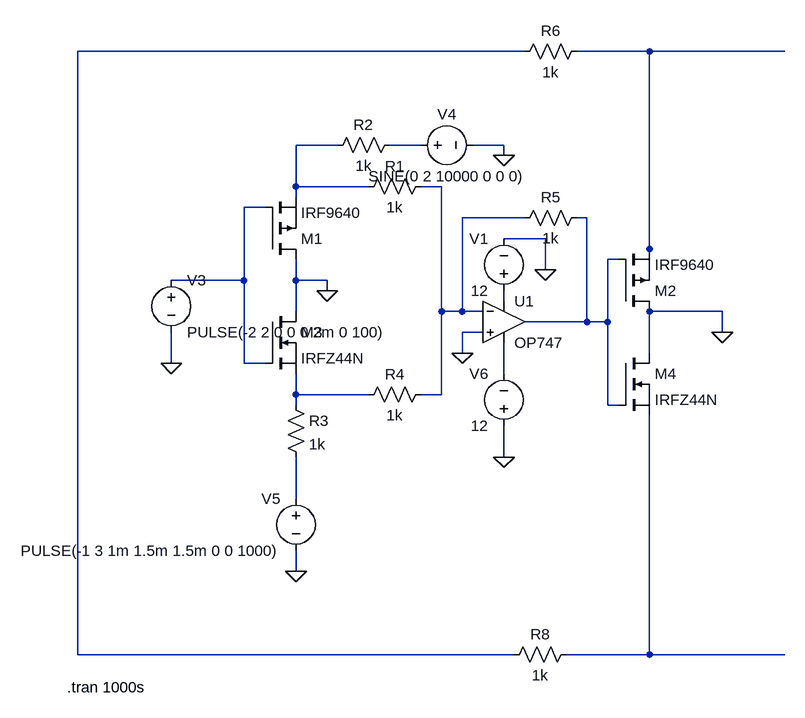
[diagram p0: schematic tdm.asc]
tdm.asc, the LTspice schematic file:
Version 4
SHEET 1 880 680
WIRE 432 -464 -256 -464
WIRE 624 -464 512 -464
WIRE 832 -464 624 -464
WIRE 144 -320 80 -320
WIRE 272 -320 224 -320
WIRE 400 -320 352 -320
WIRE 400 -304 400 -320
WIRE 80 -256 80 -320
WIRE 192 -256 80 -256
WIRE 304 -256 272 -256
WIRE 80 -240 80 -256
WIRE 32 -224 0 -224
WIRE 432 -208 336 -208
WIRE 528 -208 512 -208
WIRE 464 -176 400 -176
WIRE 624 -160 624 -464
WIRE 576 -144 560 -144
WIRE 624 -144 624 -160
WIRE 464 -128 464 -176
WIRE 0 -112 0 -224
WIRE 0 -112 -112 -112
WIRE 80 -112 80 -144
WIRE 128 -112 80 -112
WIRE 128 -96 128 -112
WIRE 400 -80 400 -96
WIRE 80 -64 80 -112
WIRE 304 -64 304 -256
WIRE 336 -64 336 -208
WIRE 336 -64 304 -64
WIRE 368 -64 336 -64
WIRE 736 -64 624 -64
WIRE 528 -48 528 -208
WIRE 528 -48 432 -48
WIRE 560 -48 560 -144
WIRE 560 -48 528 -48
WIRE 368 -32 336 -32
WIRE 736 -32 736 -64
WIRE 336 0 336 -32
WIRE 624 0 624 -64
WIRE -112 16 -112 -32
WIRE 0 16 0 -112
WIRE 32 16 0 16
WIRE 400 32 400 -16
WIRE 80 64 80 32
WIRE 192 64 80 64
WIRE 304 64 304 -64
WIRE 304 64 272 64
WIRE 80 80 80 64
WIRE 560 80 560 -48
WIRE 576 80 560 80
WIRE 400 160 400 112
WIRE 80 224 80 160
WIRE 80 336 80 304
WIRE -256 464 -256 -464
WIRE 416 464 -256 464
WIRE 624 464 624 96
WIRE 624 464 496 464
WIRE 832 464 624 464
FLAG 128 -96 0
FLAG 336 0 0
FLAG 464 -128 0
FLAG 736 -32 0
FLAG 400 -304 0
FLAG 80 336 0
FLAG -112 16 0
FLAG 400 160 0
SYMBOL pmos 32 -144 M180
SYMATTR InstName M1
SYMATTR Value IRF9640
SYMBOL nmos 32 -64 R0
SYMATTR InstName M3
SYMATTR Value IRFZ44N
SYMBOL res 288 -272 R90
WINDOW 0 0 56 VBottom 2
WINDOW 3 32 56 VTop 2
SYMATTR InstName R1
SYMATTR Value 1k
SYMBOL res 240 -336 R90
WINDOW 0 0 56 VBottom 2
WINDOW 3 32 56 VTop 2
SYMATTR InstName R2
SYMATTR Value 1k
SYMBOL res 64 64 R0
SYMATTR InstName R3
SYMATTR Value 1k
SYMBOL res 288 48 R90
WINDOW 0 0 56 VBottom 2
WINDOW 3 32 56 VTop 2
SYMATTR InstName R4
SYMATTR Value 1k
SYMBOL Opamps\\OP747 400 -112 R0
SYMATTR InstName U1
SYMBOL res 528 -224 R90
WINDOW 0 0 56 VBottom 2
WINDOW 3 32 56 VTop 2
SYMATTR InstName R5
SYMATTR Value 1k
SYMBOL pmos 576 -64 M180
SYMATTR InstName M2
SYMATTR Value IRF9640
SYMBOL nmos 576 0 R0
SYMATTR InstName M4
SYMATTR Value IRFZ44N
SYMBOL voltage 400 -80 R180
WINDOW 0 24 96 Left 2
WINDOW 3 24 16 Left 2
WINDOW 123 0 0 Left 0
WINDOW 39 0 0 Left 0
SYMATTR InstName V1
SYMATTR Value 12
SYMBOL res 528 -480 R90
WINDOW 0 0 56 VBottom 2
WINDOW 3 32 56 VTop 2
SYMATTR InstName R6
SYMATTR Value 1k
SYMBOL res 512 448 R90
WINDOW 0 0 56 VBottom 2
WINDOW 3 32 56 VTop 2
SYMATTR InstName R8
SYMATTR Value 1k
SYMBOL voltage -112 -128 R0
WINDOW 123 24 44 Left 2
WINDOW 39 0 0 Left 0
SYMATTR InstName V3
SYMATTR Value PULSE(-2 2 0 0 0 2m 0 100)
SYMBOL voltage 256 -320 R270
WINDOW 0 32 56 VTop 2
WINDOW 3 -32 56 VBottom 2
WINDOW 123 0 0 Left 0
WINDOW 39 0 0 Left 0
SYMATTR InstName V4
SYMATTR Value SINE(0 2 10000 0 0 0)
SYMBOL voltage 80 208 M0
WINDOW 123 24 124 Left 2
WINDOW 39 0 0 Left 0
SYMATTR InstName V5
SYMATTR Value PULSE(-1 3 1m 1.5m 1.5m 0 0 1000)
SYMBOL voltage 400 128 R180
WINDOW 0 24 96 Left 2
WINDOW 3 24 16 Left 2
WINDOW 123 0 0 Left 0
WINDOW 39 0 0 Left 0
SYMATTR InstName V6
SYMATTR Value 12
TEXT -272 514 Left 2 !.tran 1000s

The netlist it stands for:
* tdm.asc
M1 0 N006 N003 N003 IRF9640
M3 0 N006 N010 N010 IRFZ44N
R1 N005 N003 1k
R2 N004 N003 1k
R3 N010 N011 1k
R4 N005 N010 1k
XU1 0 N005 N008 N009 N007 OP747  ; pins In+ In- V+ V- OUT
R5 N007 N005 1k
M2 0 N007 N002 N002 IRF9640
M4 0 N007 N012 N012 IRFZ44N
V1 N008 0 12
R6 N002 N001 1k
R8 N012 N001 1k
V3 N006 0 PULSE(-2 2 0 0 0 2m 0 100)
V4 N004 0 SINE(0 2 10000 0 0 0)
V5 N011 0 PULSE(-1 3 1m 1.5m 1.5m 0 0 1000)
V6 0 N009 12
.model NMOS NMOS
.model PMOS PMOS
.lib standard.mos
.tran 1000s
.backanno
.end